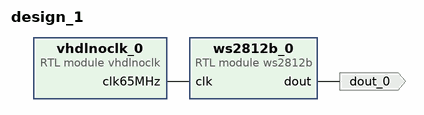
[diagram p0: block diagram of the top level]
# Vivado block design design_1, xc7z007sclg225-1, Vivado 2019.1
create_bd_design design_1

create_bd_port -dir O dout_0

create_bd_cell -type module -reference vhdlnoclk vhdlnoclk_0
create_bd_cell -type module -reference ws2812b ws2812b_0

# ---- connections ----

connect_bd_net [get_bd_pins ws2812b_0/dout] [get_bd_ports dout_0]
connect_bd_net [get_bd_pins vhdlnoclk_0/clk65MHz] [get_bd_pins ws2812b_0/clk]

validate_bd_design
save_bd_design
